# Altium schematic sheet P01_Top Level.SchDoc
size C; SheetNumber: 1; SheetTotal: 3
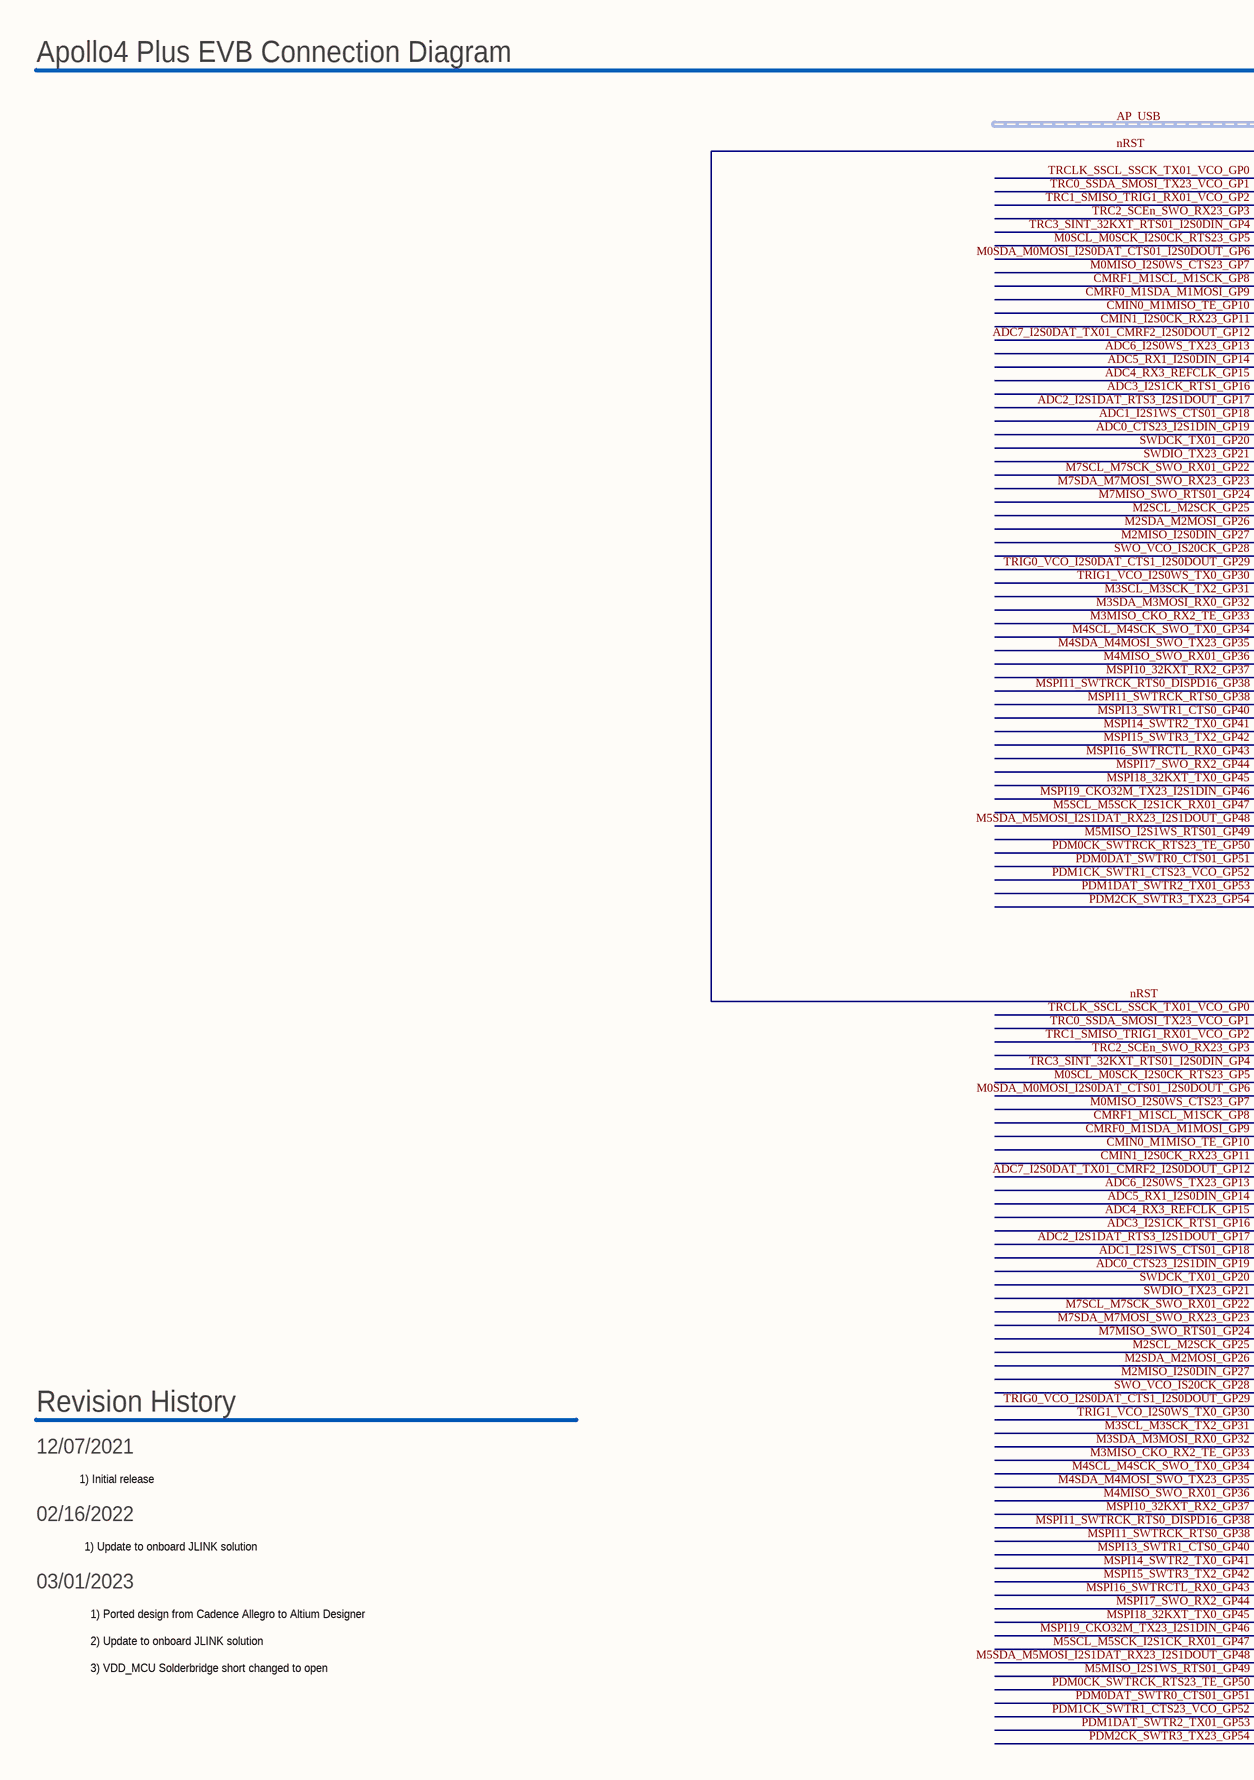
[diagram p0: P01_Top Level.SchDoc, left]
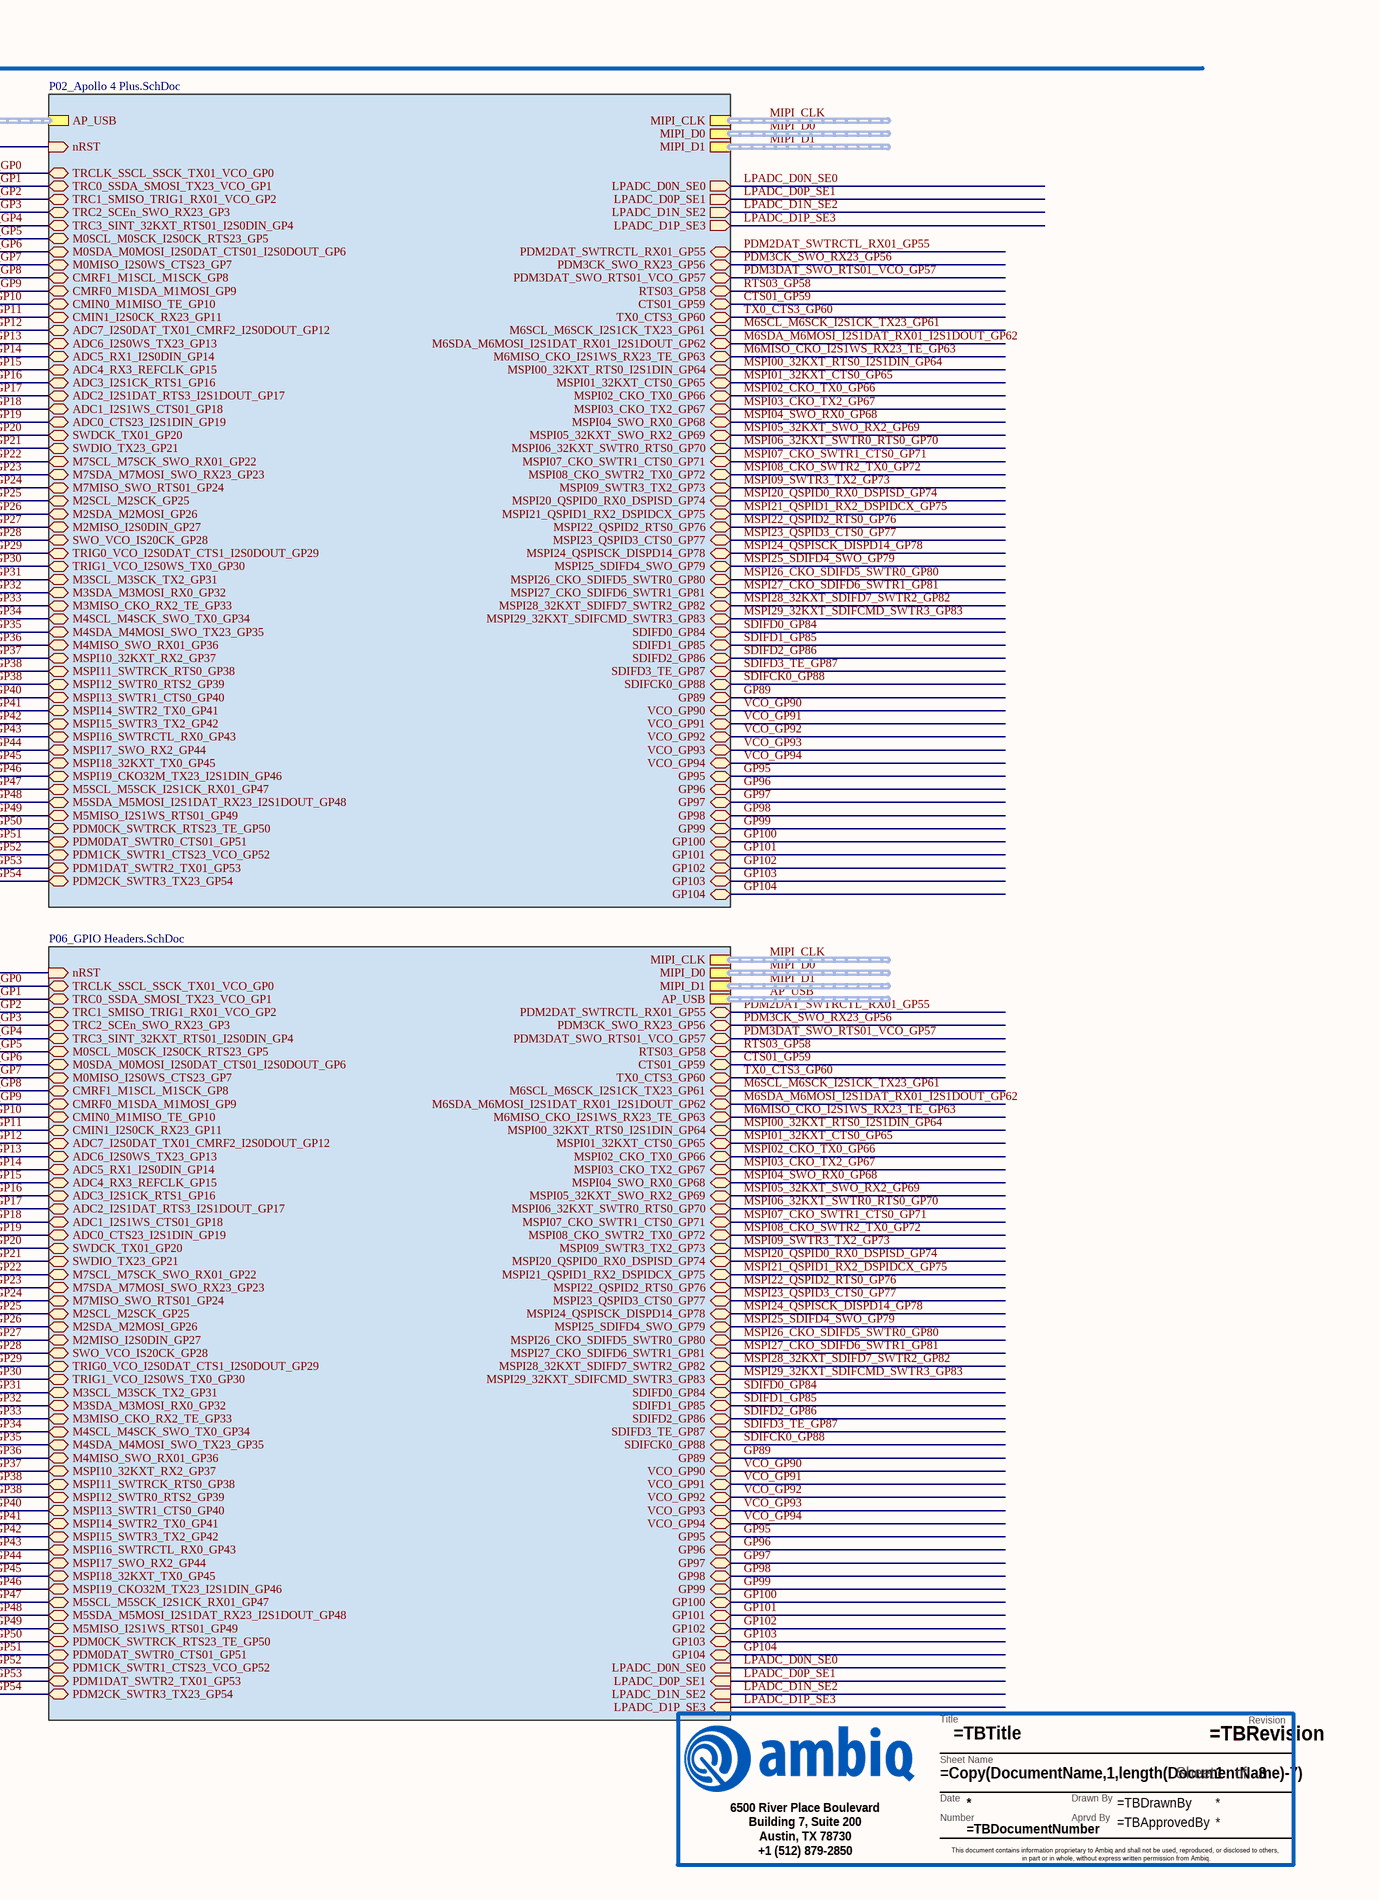
[diagram p1: P01_Top Level.SchDoc, right]

## Parts
?  TitleBlock  (value not drawn)  (graphical)

## Sub-sheets
U_P02_Apollo 4 Plus = P02_Apollo 4 Plus.SchDoc: AP_USB (harness USB), nRST (in), TRCLK_SSCL_SSCK_TX01_VCO_GP0 (bidir), TRC0_SSDA_SMOSI_TX23_VCO_GP1 (bidir), TRC1_SMISO_TRIG1_RX01_VCO_GP2 (bidir), TRC2_SCEn_SWO_RX23_GP3 (bidir), M0SCL_M0SCK_I2S0CK_RTS23_GP5 (bidir), M0SDA_M0MOSI_I2S0DAT_CTS01_I2S0DOUT_GP6 (bidir), M0MISO_I2S0WS_CTS23_GP7 (bidir), CMRF1_M1SCL_M1SCK_GP8 (bidir), CMRF0_M1SDA_M1MOSI_GP9 (bidir), CMIN0_M1MISO_TE_GP10 (bidir), CMIN1_I2S0CK_RX23_GP11 (bidir), ADC7_I2S0DAT_TX01_CMRF2_I2S0DOUT_GP12 (bidir), ADC6_I2S0WS_TX23_GP13 (bidir), ADC5_RX1_I2S0DIN_GP14 (bidir), ADC4_RX3_REFCLK_GP15 (bidir), ADC3_I2S1CK_RTS1_GP16 (bidir), ADC2_I2S1DAT_RTS3_I2S1DOUT_GP17 (bidir), ADC1_I2S1WS_CTS01_GP18 (bidir), ADC0_CTS23_I2S1DIN_GP19 (bidir), TRC3_SINT_32KXT_RTS01_I2S0DIN_GP4 (bidir), SWDCK_TX01_GP20 (bidir), SWDIO_TX23_GP21 (bidir), M7SCL_M7SCK_SWO_RX01_GP22 (bidir), M7SDA_M7MOSI_SWO_RX23_GP23 (bidir), M7MISO_SWO_RTS01_GP24 (bidir), M3SCL_M3SCK_TX2_GP31 (bidir), M3SDA_M3MOSI_RX0_GP32 (bidir), M3MISO_CKO_RX2_TE_GP33 (bidir), M4SCL_M4SCK_SWO_TX0_GP34 (bidir), M4SDA_M4MOSI_SWO_TX23_GP35 (bidir), M4MISO_SWO_RX01_GP36 (bidir), MSPI19_CKO32M_TX23_I2S1DIN_GP46 (bidir), M5SCL_M5SCK_I2S1CK_RX01_GP47 (bidir), M5SDA_M5MOSI_I2S1DAT_RX23_I2S1DOUT_GP48 (bidir), M5MISO_I2S1WS_RTS01_GP49 (bidir), MIPI_CLK (harness MIPI), MIPI_D0 (harness MIPI), MIPI_D1 (harness MIPI), PDM0CK_SWTRCK_RTS23_TE_GP50 (bidir), PDM0DAT_SWTR0_CTS01_GP51 (bidir), PDM1CK_SWTR1_CTS23_VCO_GP52 (bidir), PDM1DAT_SWTR2_TX01_GP53 (bidir), PDM2CK_SWTR3_TX23_GP54 (bidir), LPADC_D0P_SE1 (out), LPADC_D0N_SE0 (out), LPADC_D1P_SE3 (out), LPADC_D1N_SE2 (out), VCO_GP93 (bidir), CTS01_GP59 (bidir), TX0_CTS3_GP60 (bidir), M6SCL_M6SCK_I2S1CK_TX23_GP61 (bidir), M6SDA_M6MOSI_I2S1DAT_RX01_I2S1DOUT_GP62 (bidir), M6MISO_CKO_I2S1WS_RX23_TE_GP63 (bidir), SDIFD0_GP84 (bidir), SDIFD1_GP85 (bidir), SDIFD2_GP86 (bidir), SDIFD3_TE_GP87 (bidir), SDIFCK0_GP88 (bidir), VCO_GP90 (bidir), VCO_GP91 (bidir), VCO_GP92 (bidir), VCO_GP94 (bidir), GP95 (bidir), GP96 (bidir), GP97 (bidir), GP98 (bidir), GP99 (bidir), GP100 (bidir), GP101 (bidir), GP102 (bidir), GP103 (bidir), GP104 (bidir), RTS03_GP58 (bidir), PDM2DAT_SWTRCTL_RX01_GP55 (bidir), PDM3CK_SWO_RX23_GP56 (bidir), PDM3DAT_SWO_RTS01_VCO_GP57 (bidir), M2MISO_I2S0DIN_GP27 (bidir), M2SCL_M2SCK_GP25 (bidir), M2SDA_M2MOSI_GP26 (bidir), SWO_VCO_IS20CK_GP28 (bidir), TRIG0_VCO_I2S0DAT_CTS1_I2S0DOUT_GP29 (bidir), TRIG1_VCO_I2S0WS_TX0_GP30 (bidir), MSPI10_32KXT_RX2_GP37 (bidir), MSPI11_SWTRCK_RTS0_GP38 (bidir), MSPI12_SWTR0_RTS2_GP39 (bidir), MSPI13_SWTR1_CTS0_GP40 (bidir), MSPI14_SWTR2_TX0_GP41 (bidir), MSPI15_SWTR3_TX2_GP42 (bidir), MSPI16_SWTRCTL_RX0_GP43 (bidir), MSPI17_SWO_RX2_GP44 (bidir), MSPI18_32KXT_TX0_GP45 (bidir), MSPI00_32KXT_RTS0_I2S1DIN_GP64 (bidir), MSPI01_32KXT_CTS0_GP65 (bidir), MSPI02_CKO_TX0_GP66 (bidir), MSPI03_CKO_TX2_GP67 (bidir), MSPI04_SWO_RX0_GP68 (bidir), MSPI05_32KXT_SWO_RX2_GP69 (bidir), MSPI06_32KXT_SWTR0_RTS0_GP70 (bidir), MSPI07_CKO_SWTR1_CTS0_GP71 (bidir), MSPI08_CKO_SWTR2_TX0_GP72 (bidir), MSPI09_SWTR3_TX2_GP73 (bidir), MSPI20_QSPID0_RX0_DSPISD_GP74 (bidir), MSPI21_QSPID1_RX2_DSPIDCX_GP75 (bidir), MSPI22_QSPID2_RTS0_GP76 (bidir), MSPI23_QSPID3_CTS0_GP77 (bidir), MSPI24_QSPISCK_DISPD14_GP78 (bidir), MSPI25_SDIFD4_SWO_GP79 (bidir), MSPI26_CKO_SDIFD5_SWTR0_GP80 (bidir), MSPI27_CKO_SDIFD6_SWTR1_GP81 (bidir), MSPI28_32KXT_SDIFD7_SWTR2_GP82 (bidir), MSPI29_32KXT_SDIFCMD_SWTR3_GP83 (bidir), GP89 (bidir)
U_P02_Apollo 4 Plus = P06_GPIO Headers.SchDoc: MIPI_CLK (harness MIPI), MIPI_D0 (harness MIPI), MIPI_D1 (harness MIPI), VCO_GP93 (bidir), CTS01_GP59 (bidir), TX0_CTS3_GP60 (bidir), M6SCL_M6SCK_I2S1CK_TX23_GP61 (bidir), M6SDA_M6MOSI_I2S1DAT_RX01_I2S1DOUT_GP62 (bidir), M6MISO_CKO_I2S1WS_RX23_TE_GP63 (bidir), SDIFD0_GP84 (bidir), SDIFD1_GP85 (bidir), SDIFD2_GP86 (bidir), SDIFD3_TE_GP87 (bidir), SDIFCK0_GP88 (bidir), VCO_GP90 (bidir), VCO_GP91 (bidir), VCO_GP92 (bidir), VCO_GP94 (bidir), GP95 (bidir), GP96 (bidir), GP97 (bidir), GP98 (bidir), GP99 (bidir), GP100 (bidir), GP102 (bidir), RTS03_GP58 (bidir), PDM2DAT_SWTRCTL_RX01_GP55 (bidir), PDM3CK_SWO_RX23_GP56 (bidir), PDM3DAT_SWO_RTS01_VCO_GP57 (bidir), MSPI00_32KXT_RTS0_I2S1DIN_GP64 (bidir), MSPI01_32KXT_CTS0_GP65 (bidir), MSPI02_CKO_TX0_GP66 (bidir), MSPI03_CKO_TX2_GP67 (bidir), MSPI04_SWO_RX0_GP68 (bidir), MSPI05_32KXT_SWO_RX2_GP69 (bidir), MSPI06_32KXT_SWTR0_RTS0_GP70 (bidir), MSPI07_CKO_SWTR1_CTS0_GP71 (bidir), MSPI08_CKO_SWTR2_TX0_GP72 (bidir), MSPI09_SWTR3_TX2_GP73 (bidir), MSPI20_QSPID0_RX0_DSPISD_GP74 (bidir), MSPI21_QSPID1_RX2_DSPIDCX_GP75 (bidir), MSPI22_QSPID2_RTS0_GP76 (bidir), MSPI23_QSPID3_CTS0_GP77 (bidir), MSPI24_QSPISCK_DISPD14_GP78 (bidir), MSPI25_SDIFD4_SWO_GP79 (bidir), MSPI26_CKO_SDIFD5_SWTR0_GP80 (bidir), MSPI27_CKO_SDIFD6_SWTR1_GP81 (bidir), MSPI28_32KXT_SDIFD7_SWTR2_GP82 (bidir), MSPI29_32KXT_SDIFCMD_SWTR3_GP83 (bidir), GP89 (bidir), nRST (in), TRCLK_SSCL_SSCK_TX01_VCO_GP0 (bidir), TRC0_SSDA_SMOSI_TX23_VCO_GP1 (bidir), TRC1_SMISO_TRIG1_RX01_VCO_GP2 (bidir), TRC2_SCEn_SWO_RX23_GP3 (bidir), M0SCL_M0SCK_I2S0CK_RTS23_GP5 (bidir), M0SDA_M0MOSI_I2S0DAT_CTS01_I2S0DOUT_GP6 (bidir), M0MISO_I2S0WS_CTS23_GP7 (bidir), CMRF1_M1SCL_M1SCK_GP8 (bidir), CMRF0_M1SDA_M1MOSI_GP9 (bidir), CMIN0_M1MISO_TE_GP10 (bidir), CMIN1_I2S0CK_RX23_GP11 (bidir), ADC7_I2S0DAT_TX01_CMRF2_I2S0DOUT_GP12 (bidir), ADC6_I2S0WS_TX23_GP13 (bidir), ADC5_RX1_I2S0DIN_GP14 (bidir), ADC4_RX3_REFCLK_GP15 (bidir), ADC3_I2S1CK_RTS1_GP16 (bidir), ADC2_I2S1DAT_RTS3_I2S1DOUT_GP17 (bidir), ADC1_I2S1WS_CTS01_GP18 (bidir), ADC0_CTS23_I2S1DIN_GP19 (bidir), TRC3_SINT_32KXT_RTS01_I2S0DIN_GP4 (bidir), M7SCL_M7SCK_SWO_RX01_GP22 (bidir), M7SDA_M7MOSI_SWO_RX23_GP23 (bidir), M7MISO_SWO_RTS01_GP24 (bidir), M3SCL_M3SCK_TX2_GP31 (bidir), M3SDA_M3MOSI_RX0_GP32 (bidir), M3MISO_CKO_RX2_TE_GP33 (bidir), M4SCL_M4SCK_SWO_TX0_GP34 (bidir), M4SDA_M4MOSI_SWO_TX23_GP35 (bidir), M4MISO_SWO_RX01_GP36 (bidir), MSPI19_CKO32M_TX23_I2S1DIN_GP46 (bidir), M5SCL_M5SCK_I2S1CK_RX01_GP47 (bidir), M5SDA_M5MOSI_I2S1DAT_RX23_I2S1DOUT_GP48 (bidir), M5MISO_I2S1WS_RTS01_GP49 (bidir), PDM0CK_SWTRCK_RTS23_TE_GP50 (bidir), PDM0DAT_SWTR0_CTS01_GP51 (bidir), PDM1CK_SWTR1_CTS23_VCO_GP52 (bidir), PDM1DAT_SWTR2_TX01_GP53 (bidir), PDM2CK_SWTR3_TX23_GP54 (bidir), M2MISO_I2S0DIN_GP27 (bidir), M2SCL_M2SCK_GP25 (bidir), M2SDA_M2MOSI_GP26 (bidir), SWO_VCO_IS20CK_GP28 (bidir), TRIG0_VCO_I2S0DAT_CTS1_I2S0DOUT_GP29 (bidir), TRIG1_VCO_I2S0WS_TX0_GP30 (bidir), MSPI10_32KXT_RX2_GP37 (bidir), MSPI11_SWTRCK_RTS0_GP38 (bidir), MSPI12_SWTR0_RTS2_GP39 (bidir), MSPI13_SWTR1_CTS0_GP40 (bidir), MSPI14_SWTR2_TX0_GP41 (bidir), MSPI15_SWTR3_TX2_GP42 (bidir), MSPI16_SWTRCTL_RX0_GP43 (bidir), MSPI17_SWO_RX2_GP44 (bidir), MSPI18_32KXT_TX0_GP45 (bidir), GP101 (bidir), GP103 (bidir), GP104 (bidir), SWDCK_TX01_GP20 (bidir), SWDIO_TX23_GP21 (bidir), AP_USB (harness USB), LPADC_D0N_SE0 (in), LPADC_D0P_SE1 (in), LPADC_D1N_SE2 (in), LPADC_D1P_SE3 (in)

## Nets
ADC0_CTS23_I2S1DIN_GP19: sheet U_P02_Apollo 4 Plus/ADC0_CTS23_I2S1DIN_GP19, sheet U_P02_Apollo 4 Plus/ADC0_CTS23_I2S1DIN_GP19
ADC1_I2S1WS_CTS01_GP18: sheet U_P02_Apollo 4 Plus/ADC1_I2S1WS_CTS01_GP18, sheet U_P02_Apollo 4 Plus/ADC1_I2S1WS_CTS01_GP18
ADC2_I2S1DAT_RTS3_I2S1DOUT_GP17: sheet U_P02_Apollo 4 Plus/ADC2_I2S1DAT_RTS3_I2S1DOUT_GP17, sheet U_P02_Apollo 4 Plus/ADC2_I2S1DAT_RTS3_I2S1DOUT_GP17
ADC3_I2S1CK_RTS1_GP16: sheet U_P02_Apollo 4 Plus/ADC3_I2S1CK_RTS1_GP16, sheet U_P02_Apollo 4 Plus/ADC3_I2S1CK_RTS1_GP16
ADC4_RX3_REFCLK_GP15: sheet U_P02_Apollo 4 Plus/ADC4_RX3_REFCLK_GP15, sheet U_P02_Apollo 4 Plus/ADC4_RX3_REFCLK_GP15
ADC5_RX1_I2S0DIN_GP14: sheet U_P02_Apollo 4 Plus/ADC5_RX1_I2S0DIN_GP14, sheet U_P02_Apollo 4 Plus/ADC5_RX1_I2S0DIN_GP14
ADC6_I2S0WS_TX23_GP13: sheet U_P02_Apollo 4 Plus/ADC6_I2S0WS_TX23_GP13, sheet U_P02_Apollo 4 Plus/ADC6_I2S0WS_TX23_GP13
ADC7_I2S0DAT_TX01_CMRF2_I2S0DOUT_GP12: sheet U_P02_Apollo 4 Plus/ADC7_I2S0DAT_TX01_CMRF2_I2S0DOUT_GP12, sheet U_P02_Apollo 4 Plus/ADC7_I2S0DAT_TX01_CMRF2_I2S0DOUT_GP12
CMIN0_M1MISO_TE_GP10: sheet U_P02_Apollo 4 Plus/CMIN0_M1MISO_TE_GP10, sheet U_P02_Apollo 4 Plus/CMIN0_M1MISO_TE_GP10
CMIN1_I2S0CK_RX23_GP11: sheet U_P02_Apollo 4 Plus/CMIN1_I2S0CK_RX23_GP11, sheet U_P02_Apollo 4 Plus/CMIN1_I2S0CK_RX23_GP11
CMRF0_M1SDA_M1MOSI_GP9: sheet U_P02_Apollo 4 Plus/CMRF0_M1SDA_M1MOSI_GP9, sheet U_P02_Apollo 4 Plus/CMRF0_M1SDA_M1MOSI_GP9
CMRF1_M1SCL_M1SCK_GP8: sheet U_P02_Apollo 4 Plus/CMRF1_M1SCL_M1SCK_GP8, sheet U_P02_Apollo 4 Plus/CMRF1_M1SCL_M1SCK_GP8
CTS01_GP59: sheet U_P02_Apollo 4 Plus/CTS01_GP59, sheet U_P02_Apollo 4 Plus/CTS01_GP59
GP89: sheet U_P02_Apollo 4 Plus/GP89, sheet U_P02_Apollo 4 Plus/GP89
GP95: sheet U_P02_Apollo 4 Plus/GP95, sheet U_P02_Apollo 4 Plus/GP95
GP96: sheet U_P02_Apollo 4 Plus/GP96, sheet U_P02_Apollo 4 Plus/GP96
GP97: sheet U_P02_Apollo 4 Plus/GP97, sheet U_P02_Apollo 4 Plus/GP97
GP98: sheet U_P02_Apollo 4 Plus/GP98, sheet U_P02_Apollo 4 Plus/GP98
GP99: sheet U_P02_Apollo 4 Plus/GP99, sheet U_P02_Apollo 4 Plus/GP99
GP100: sheet U_P02_Apollo 4 Plus/GP100, sheet U_P02_Apollo 4 Plus/GP100
GP101: sheet U_P02_Apollo 4 Plus/GP101, sheet U_P02_Apollo 4 Plus/GP101
GP102: sheet U_P02_Apollo 4 Plus/GP102, sheet U_P02_Apollo 4 Plus/GP102
GP103: sheet U_P02_Apollo 4 Plus/GP103, sheet U_P02_Apollo 4 Plus/GP103
GP104: sheet U_P02_Apollo 4 Plus/GP104, sheet U_P02_Apollo 4 Plus/GP104
LPADC_D0N_SE0: sheet U_P02_Apollo 4 Plus/LPADC_D0N_SE0, sheet U_P02_Apollo 4 Plus/LPADC_D0N_SE0
LPADC_D0P_SE1: sheet U_P02_Apollo 4 Plus/LPADC_D0P_SE1, sheet U_P02_Apollo 4 Plus/LPADC_D0P_SE1
LPADC_D1N_SE2: sheet U_P02_Apollo 4 Plus/LPADC_D1N_SE2, sheet U_P02_Apollo 4 Plus/LPADC_D1N_SE2
LPADC_D1P_SE3: sheet U_P02_Apollo 4 Plus/LPADC_D1P_SE3, sheet U_P02_Apollo 4 Plus/LPADC_D1P_SE3
M0MISO_I2S0WS_CTS23_GP7: sheet U_P02_Apollo 4 Plus/M0MISO_I2S0WS_CTS23_GP7, sheet U_P02_Apollo 4 Plus/M0MISO_I2S0WS_CTS23_GP7
M0SCL_M0SCK_I2S0CK_RTS23_GP5: sheet U_P02_Apollo 4 Plus/M0SCL_M0SCK_I2S0CK_RTS23_GP5, sheet U_P02_Apollo 4 Plus/M0SCL_M0SCK_I2S0CK_RTS23_GP5
M0SDA_M0MOSI_I2S0DAT_CTS01_I2S0DOUT_GP6: sheet U_P02_Apollo 4 Plus/M0SDA_M0MOSI_I2S0DAT_CTS01_I2S0DOUT_GP6, sheet U_P02_Apollo 4 Plus/M0SDA_M0MOSI_I2S0DAT_CTS01_I2S0DOUT_GP6
M2MISO_I2S0DIN_GP27: sheet U_P02_Apollo 4 Plus/M2MISO_I2S0DIN_GP27, sheet U_P02_Apollo 4 Plus/M2MISO_I2S0DIN_GP27
M2SCL_M2SCK_GP25: sheet U_P02_Apollo 4 Plus/M2SCL_M2SCK_GP25, sheet U_P02_Apollo 4 Plus/M2SCL_M2SCK_GP25
M2SDA_M2MOSI_GP26: sheet U_P02_Apollo 4 Plus/M2SDA_M2MOSI_GP26, sheet U_P02_Apollo 4 Plus/M2SDA_M2MOSI_GP26
M3MISO_CKO_RX2_TE_GP33: sheet U_P02_Apollo 4 Plus/M3MISO_CKO_RX2_TE_GP33, sheet U_P02_Apollo 4 Plus/M3MISO_CKO_RX2_TE_GP33
M3SCL_M3SCK_TX2_GP31: sheet U_P02_Apollo 4 Plus/M3SCL_M3SCK_TX2_GP31, sheet U_P02_Apollo 4 Plus/M3SCL_M3SCK_TX2_GP31
M3SDA_M3MOSI_RX0_GP32: sheet U_P02_Apollo 4 Plus/M3SDA_M3MOSI_RX0_GP32, sheet U_P02_Apollo 4 Plus/M3SDA_M3MOSI_RX0_GP32
M4MISO_SWO_RX01_GP36: sheet U_P02_Apollo 4 Plus/M4MISO_SWO_RX01_GP36, sheet U_P02_Apollo 4 Plus/M4MISO_SWO_RX01_GP36
M4SCL_M4SCK_SWO_TX0_GP34: sheet U_P02_Apollo 4 Plus/M4SCL_M4SCK_SWO_TX0_GP34, sheet U_P02_Apollo 4 Plus/M4SCL_M4SCK_SWO_TX0_GP34
M4SDA_M4MOSI_SWO_TX23_GP35: sheet U_P02_Apollo 4 Plus/M4SDA_M4MOSI_SWO_TX23_GP35, sheet U_P02_Apollo 4 Plus/M4SDA_M4MOSI_SWO_TX23_GP35
M5MISO_I2S1WS_RTS01_GP49: sheet U_P02_Apollo 4 Plus/M5MISO_I2S1WS_RTS01_GP49, sheet U_P02_Apollo 4 Plus/M5MISO_I2S1WS_RTS01_GP49
M5SCL_M5SCK_I2S1CK_RX01_GP47: sheet U_P02_Apollo 4 Plus/M5SCL_M5SCK_I2S1CK_RX01_GP47, sheet U_P02_Apollo 4 Plus/M5SCL_M5SCK_I2S1CK_RX01_GP47
M5SDA_M5MOSI_I2S1DAT_RX23_I2S1DOUT_GP48: sheet U_P02_Apollo 4 Plus/M5SDA_M5MOSI_I2S1DAT_RX23_I2S1DOUT_GP48, sheet U_P02_Apollo 4 Plus/M5SDA_M5MOSI_I2S1DAT_RX23_I2S1DOUT_GP48
M6MISO_CKO_I2S1WS_RX23_TE_GP63: sheet U_P02_Apollo 4 Plus/M6MISO_CKO_I2S1WS_RX23_TE_GP63, sheet U_P02_Apollo 4 Plus/M6MISO_CKO_I2S1WS_RX23_TE_GP63
M6SCL_M6SCK_I2S1CK_TX23_GP61: sheet U_P02_Apollo 4 Plus/M6SCL_M6SCK_I2S1CK_TX23_GP61, sheet U_P02_Apollo 4 Plus/M6SCL_M6SCK_I2S1CK_TX23_GP61
M6SDA_M6MOSI_I2S1DAT_RX01_I2S1DOUT_GP62: sheet U_P02_Apollo 4 Plus/M6SDA_M6MOSI_I2S1DAT_RX01_I2S1DOUT_GP62, sheet U_P02_Apollo 4 Plus/M6SDA_M6MOSI_I2S1DAT_RX01_I2S1DOUT_GP62
M7MISO_SWO_RTS01_GP24: sheet U_P02_Apollo 4 Plus/M7MISO_SWO_RTS01_GP24, sheet U_P02_Apollo 4 Plus/M7MISO_SWO_RTS01_GP24
M7SCL_M7SCK_SWO_RX01_GP22: sheet U_P02_Apollo 4 Plus/M7SCL_M7SCK_SWO_RX01_GP22, sheet U_P02_Apollo 4 Plus/M7SCL_M7SCK_SWO_RX01_GP22
M7SDA_M7MOSI_SWO_RX23_GP23: sheet U_P02_Apollo 4 Plus/M7SDA_M7MOSI_SWO_RX23_GP23, sheet U_P02_Apollo 4 Plus/M7SDA_M7MOSI_SWO_RX23_GP23
MSPI00_32KXT_RTS0_I2S1DIN_GP64: sheet U_P02_Apollo 4 Plus/MSPI00_32KXT_RTS0_I2S1DIN_GP64, sheet U_P02_Apollo 4 Plus/MSPI00_32KXT_RTS0_I2S1DIN_GP64
MSPI01_32KXT_CTS0_GP65: sheet U_P02_Apollo 4 Plus/MSPI01_32KXT_CTS0_GP65, sheet U_P02_Apollo 4 Plus/MSPI01_32KXT_CTS0_GP65
MSPI02_CKO_TX0_GP66: sheet U_P02_Apollo 4 Plus/MSPI02_CKO_TX0_GP66, sheet U_P02_Apollo 4 Plus/MSPI02_CKO_TX0_GP66
MSPI03_CKO_TX2_GP67: sheet U_P02_Apollo 4 Plus/MSPI03_CKO_TX2_GP67, sheet U_P02_Apollo 4 Plus/MSPI03_CKO_TX2_GP67
MSPI04_SWO_RX0_GP68: sheet U_P02_Apollo 4 Plus/MSPI04_SWO_RX0_GP68, sheet U_P02_Apollo 4 Plus/MSPI04_SWO_RX0_GP68
MSPI05_32KXT_SWO_RX2_GP69: sheet U_P02_Apollo 4 Plus/MSPI05_32KXT_SWO_RX2_GP69, sheet U_P02_Apollo 4 Plus/MSPI05_32KXT_SWO_RX2_GP69
MSPI06_32KXT_SWTR0_RTS0_GP70: sheet U_P02_Apollo 4 Plus/MSPI06_32KXT_SWTR0_RTS0_GP70, sheet U_P02_Apollo 4 Plus/MSPI06_32KXT_SWTR0_RTS0_GP70
MSPI07_CKO_SWTR1_CTS0_GP71: sheet U_P02_Apollo 4 Plus/MSPI07_CKO_SWTR1_CTS0_GP71, sheet U_P02_Apollo 4 Plus/MSPI07_CKO_SWTR1_CTS0_GP71
MSPI08_CKO_SWTR2_TX0_GP72: sheet U_P02_Apollo 4 Plus/MSPI08_CKO_SWTR2_TX0_GP72, sheet U_P02_Apollo 4 Plus/MSPI08_CKO_SWTR2_TX0_GP72
MSPI09_SWTR3_TX2_GP73: sheet U_P02_Apollo 4 Plus/MSPI09_SWTR3_TX2_GP73, sheet U_P02_Apollo 4 Plus/MSPI09_SWTR3_TX2_GP73
MSPI10_32KXT_RX2_GP37: sheet U_P02_Apollo 4 Plus/MSPI10_32KXT_RX2_GP37, sheet U_P02_Apollo 4 Plus/MSPI10_32KXT_RX2_GP37
MSPI11_SWTRCK_RTS0_DISPD16_GP38: sheet U_P02_Apollo 4 Plus/MSPI11_SWTRCK_RTS0_GP38, sheet U_P02_Apollo 4 Plus/MSPI11_SWTRCK_RTS0_GP38
MSPI11_SWTRCK_RTS0_GP38: sheet U_P02_Apollo 4 Plus/MSPI12_SWTR0_RTS2_GP39, sheet U_P02_Apollo 4 Plus/MSPI12_SWTR0_RTS2_GP39
MSPI13_SWTR1_CTS0_GP40: sheet U_P02_Apollo 4 Plus/MSPI13_SWTR1_CTS0_GP40, sheet U_P02_Apollo 4 Plus/MSPI13_SWTR1_CTS0_GP40
MSPI14_SWTR2_TX0_GP41: sheet U_P02_Apollo 4 Plus/MSPI14_SWTR2_TX0_GP41, sheet U_P02_Apollo 4 Plus/MSPI14_SWTR2_TX0_GP41
MSPI15_SWTR3_TX2_GP42: sheet U_P02_Apollo 4 Plus/MSPI15_SWTR3_TX2_GP42, sheet U_P02_Apollo 4 Plus/MSPI15_SWTR3_TX2_GP42
MSPI16_SWTRCTL_RX0_GP43: sheet U_P02_Apollo 4 Plus/MSPI16_SWTRCTL_RX0_GP43, sheet U_P02_Apollo 4 Plus/MSPI16_SWTRCTL_RX0_GP43
MSPI17_SWO_RX2_GP44: sheet U_P02_Apollo 4 Plus/MSPI17_SWO_RX2_GP44, sheet U_P02_Apollo 4 Plus/MSPI17_SWO_RX2_GP44
MSPI18_32KXT_TX0_GP45: sheet U_P02_Apollo 4 Plus/MSPI18_32KXT_TX0_GP45, sheet U_P02_Apollo 4 Plus/MSPI18_32KXT_TX0_GP45
MSPI19_CKO32M_TX23_I2S1DIN_GP46: sheet U_P02_Apollo 4 Plus/MSPI19_CKO32M_TX23_I2S1DIN_GP46, sheet U_P02_Apollo 4 Plus/MSPI19_CKO32M_TX23_I2S1DIN_GP46
MSPI20_QSPID0_RX0_DSPISD_GP74: sheet U_P02_Apollo 4 Plus/MSPI20_QSPID0_RX0_DSPISD_GP74, sheet U_P02_Apollo 4 Plus/MSPI20_QSPID0_RX0_DSPISD_GP74
MSPI21_QSPID1_RX2_DSPIDCX_GP75: sheet U_P02_Apollo 4 Plus/MSPI21_QSPID1_RX2_DSPIDCX_GP75, sheet U_P02_Apollo 4 Plus/MSPI21_QSPID1_RX2_DSPIDCX_GP75
MSPI22_QSPID2_RTS0_GP76: sheet U_P02_Apollo 4 Plus/MSPI22_QSPID2_RTS0_GP76, sheet U_P02_Apollo 4 Plus/MSPI22_QSPID2_RTS0_GP76
MSPI23_QSPID3_CTS0_GP77: sheet U_P02_Apollo 4 Plus/MSPI23_QSPID3_CTS0_GP77, sheet U_P02_Apollo 4 Plus/MSPI23_QSPID3_CTS0_GP77
MSPI24_QSPISCK_DISPD14_GP78: sheet U_P02_Apollo 4 Plus/MSPI24_QSPISCK_DISPD14_GP78, sheet U_P02_Apollo 4 Plus/MSPI24_QSPISCK_DISPD14_GP78
MSPI25_SDIFD4_SWO_GP79: sheet U_P02_Apollo 4 Plus/MSPI25_SDIFD4_SWO_GP79, sheet U_P02_Apollo 4 Plus/MSPI25_SDIFD4_SWO_GP79
MSPI26_CKO_SDIFD5_SWTR0_GP80: sheet U_P02_Apollo 4 Plus/MSPI26_CKO_SDIFD5_SWTR0_GP80, sheet U_P02_Apollo 4 Plus/MSPI26_CKO_SDIFD5_SWTR0_GP80
MSPI27_CKO_SDIFD6_SWTR1_GP81: sheet U_P02_Apollo 4 Plus/MSPI27_CKO_SDIFD6_SWTR1_GP81, sheet U_P02_Apollo 4 Plus/MSPI27_CKO_SDIFD6_SWTR1_GP81
MSPI28_32KXT_SDIFD7_SWTR2_GP82: sheet U_P02_Apollo 4 Plus/MSPI28_32KXT_SDIFD7_SWTR2_GP82, sheet U_P02_Apollo 4 Plus/MSPI28_32KXT_SDIFD7_SWTR2_GP82
MSPI29_32KXT_SDIFCMD_SWTR3_GP83: sheet U_P02_Apollo 4 Plus/MSPI29_32KXT_SDIFCMD_SWTR3_GP83, sheet U_P02_Apollo 4 Plus/MSPI29_32KXT_SDIFCMD_SWTR3_GP83
nRST: sheet U_P02_Apollo 4 Plus/nRST, sheet U_P02_Apollo 4 Plus/nRST
PDM0CK_SWTRCK_RTS23_TE_GP50: sheet U_P02_Apollo 4 Plus/PDM0CK_SWTRCK_RTS23_TE_GP50, sheet U_P02_Apollo 4 Plus/PDM0CK_SWTRCK_RTS23_TE_GP50
PDM0DAT_SWTR0_CTS01_GP51: sheet U_P02_Apollo 4 Plus/PDM0DAT_SWTR0_CTS01_GP51, sheet U_P02_Apollo 4 Plus/PDM0DAT_SWTR0_CTS01_GP51
PDM1CK_SWTR1_CTS23_VCO_GP52: sheet U_P02_Apollo 4 Plus/PDM1CK_SWTR1_CTS23_VCO_GP52, sheet U_P02_Apollo 4 Plus/PDM1CK_SWTR1_CTS23_VCO_GP52
PDM1DAT_SWTR2_TX01_GP53: sheet U_P02_Apollo 4 Plus/PDM1DAT_SWTR2_TX01_GP53, sheet U_P02_Apollo 4 Plus/PDM1DAT_SWTR2_TX01_GP53
PDM2CK_SWTR3_TX23_GP54: sheet U_P02_Apollo 4 Plus/PDM2CK_SWTR3_TX23_GP54, sheet U_P02_Apollo 4 Plus/PDM2CK_SWTR3_TX23_GP54
PDM2DAT_SWTRCTL_RX01_GP55: sheet U_P02_Apollo 4 Plus/PDM2DAT_SWTRCTL_RX01_GP55, sheet U_P02_Apollo 4 Plus/PDM2DAT_SWTRCTL_RX01_GP55
PDM3CK_SWO_RX23_GP56: sheet U_P02_Apollo 4 Plus/PDM3CK_SWO_RX23_GP56, sheet U_P02_Apollo 4 Plus/PDM3CK_SWO_RX23_GP56
PDM3DAT_SWO_RTS01_VCO_GP57: sheet U_P02_Apollo 4 Plus/PDM3DAT_SWO_RTS01_VCO_GP57, sheet U_P02_Apollo 4 Plus/PDM3DAT_SWO_RTS01_VCO_GP57
RTS03_GP58: sheet U_P02_Apollo 4 Plus/RTS03_GP58, sheet U_P02_Apollo 4 Plus/RTS03_GP58
SDIFCK0_GP88: sheet U_P02_Apollo 4 Plus/SDIFCK0_GP88, sheet U_P02_Apollo 4 Plus/SDIFCK0_GP88
SDIFD0_GP84: sheet U_P02_Apollo 4 Plus/SDIFD0_GP84, sheet U_P02_Apollo 4 Plus/SDIFD0_GP84
SDIFD1_GP85: sheet U_P02_Apollo 4 Plus/SDIFD1_GP85, sheet U_P02_Apollo 4 Plus/SDIFD1_GP85
SDIFD2_GP86: sheet U_P02_Apollo 4 Plus/SDIFD2_GP86, sheet U_P02_Apollo 4 Plus/SDIFD2_GP86
SDIFD3_TE_GP87: sheet U_P02_Apollo 4 Plus/SDIFD3_TE_GP87, sheet U_P02_Apollo 4 Plus/SDIFD3_TE_GP87
SWDCK_TX01_GP20: sheet U_P02_Apollo 4 Plus/SWDCK_TX01_GP20, sheet U_P02_Apollo 4 Plus/SWDCK_TX01_GP20
SWDIO_TX23_GP21: sheet U_P02_Apollo 4 Plus/SWDIO_TX23_GP21, sheet U_P02_Apollo 4 Plus/SWDIO_TX23_GP21
SWO_VCO_IS20CK_GP28: sheet U_P02_Apollo 4 Plus/SWO_VCO_IS20CK_GP28, sheet U_P02_Apollo 4 Plus/SWO_VCO_IS20CK_GP28
TRC0_SSDA_SMOSI_TX23_VCO_GP1: sheet U_P02_Apollo 4 Plus/TRC0_SSDA_SMOSI_TX23_VCO_GP1, sheet U_P02_Apollo 4 Plus/TRC0_SSDA_SMOSI_TX23_VCO_GP1
TRC1_SMISO_TRIG1_RX01_VCO_GP2: sheet U_P02_Apollo 4 Plus/TRC1_SMISO_TRIG1_RX01_VCO_GP2, sheet U_P02_Apollo 4 Plus/TRC1_SMISO_TRIG1_RX01_VCO_GP2
TRC2_SCEn_SWO_RX23_GP3: sheet U_P02_Apollo 4 Plus/TRC2_SCEn_SWO_RX23_GP3, sheet U_P02_Apollo 4 Plus/TRC2_SCEn_SWO_RX23_GP3
TRC3_SINT_32KXT_RTS01_I2S0DIN_GP4: sheet U_P02_Apollo 4 Plus/TRC3_SINT_32KXT_RTS01_I2S0DIN_GP4, sheet U_P02_Apollo 4 Plus/TRC3_SINT_32KXT_RTS01_I2S0DIN_GP4
TRCLK_SSCL_SSCK_TX01_VCO_GP0: sheet U_P02_Apollo 4 Plus/TRCLK_SSCL_SSCK_TX01_VCO_GP0, sheet U_P02_Apollo 4 Plus/TRCLK_SSCL_SSCK_TX01_VCO_GP0
TRIG0_VCO_I2S0DAT_CTS1_I2S0DOUT_GP29: sheet U_P02_Apollo 4 Plus/TRIG0_VCO_I2S0DAT_CTS1_I2S0DOUT_GP29, sheet U_P02_Apollo 4 Plus/TRIG0_VCO_I2S0DAT_CTS1_I2S0DOUT_GP29
TRIG1_VCO_I2S0WS_TX0_GP30: sheet U_P02_Apollo 4 Plus/TRIG1_VCO_I2S0WS_TX0_GP30, sheet U_P02_Apollo 4 Plus/TRIG1_VCO_I2S0WS_TX0_GP30
TX0_CTS3_GP60: sheet U_P02_Apollo 4 Plus/TX0_CTS3_GP60, sheet U_P02_Apollo 4 Plus/TX0_CTS3_GP60
VCO_GP90: sheet U_P02_Apollo 4 Plus/VCO_GP90, sheet U_P02_Apollo 4 Plus/VCO_GP90
VCO_GP91: sheet U_P02_Apollo 4 Plus/VCO_GP91, sheet U_P02_Apollo 4 Plus/VCO_GP91
VCO_GP92: sheet U_P02_Apollo 4 Plus/VCO_GP92, sheet U_P02_Apollo 4 Plus/VCO_GP92
VCO_GP93: sheet U_P02_Apollo 4 Plus/VCO_GP93, sheet U_P02_Apollo 4 Plus/VCO_GP93
VCO_GP94: sheet U_P02_Apollo 4 Plus/VCO_GP94, sheet U_P02_Apollo 4 Plus/VCO_GP94

## Buses and harness runs
harness AP_USB = sheet U_P02_Apollo 4 Plus/AP_USB
harness MIPI_CLK = sheet U_P02_Apollo 4 Plus/MIPI_CLK
harness MIPI_D0 = sheet U_P02_Apollo 4 Plus/MIPI_D0
harness MIPI_D1 = sheet U_P02_Apollo 4 Plus/MIPI_D1

## Notes on the sheet
- Apollo4 Plus EVB Connection Diagram
- Revision History
- 12/07/2021
- 1) Initial release
- 02/16/2022
- 1) Update to onboard JLINK solution
- 03/01/2023
- 2) Update to onboard JLINK solution
- 1) Ported design from Cadence Allegro to Altium Designer
- 3) VDD_MCU Solderbridge short changed to open
- (in symbol TitleBlock) Revision; Title; Sheet Name; Sheet; of; Date; Drawn By; Number; Aprvd By; 6500 River Place Boulevard / Building 7, Suite 200 / Austin, TX 78730 / +1 (512) 879-2850; This document contains information proprietary to Ambiq and shall not be used, reproduced, or disclosed to others, / in part or in whole, without express written permission from Ambiq.

## Library data of the parts
? = TitleBlock: Title block for Ambiq Schematics. Please have the following parameters entered in Project>Project Options>Parameters: / TBTitle / TBDocumentNumber / TBRevision / TBDrawnBy / TBApprovedBy; AMBIQ PN: TitleBlock